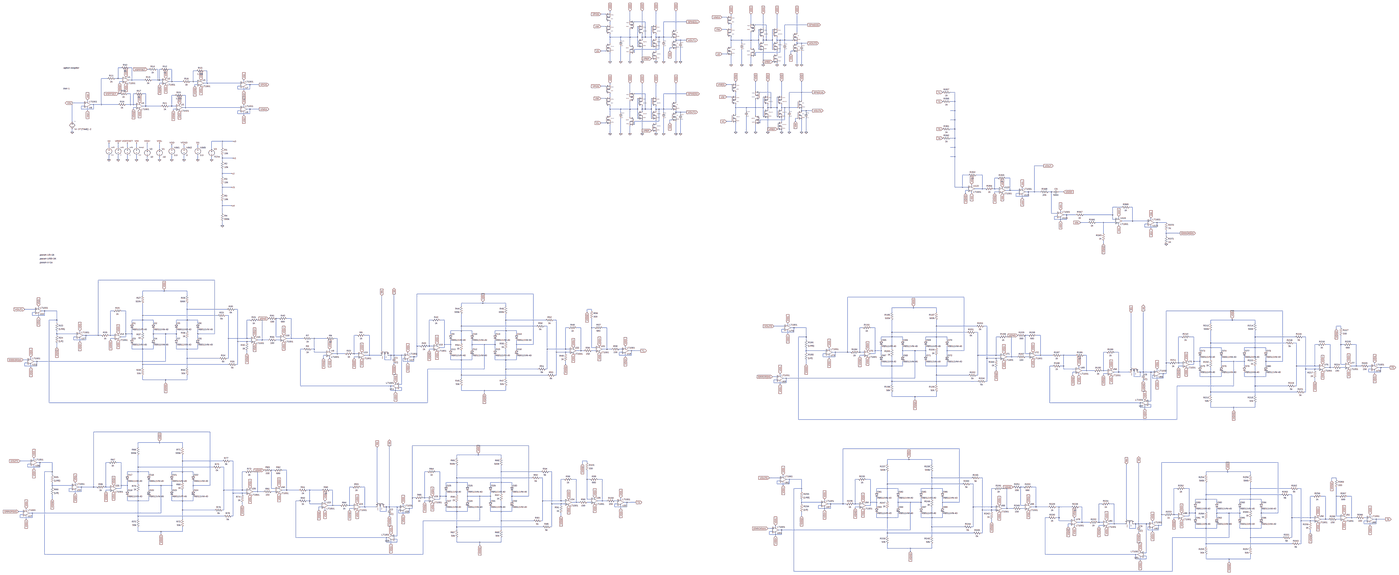
[diagram p0: schematic OZ_8_bounded_curves.asc, whole sheet]
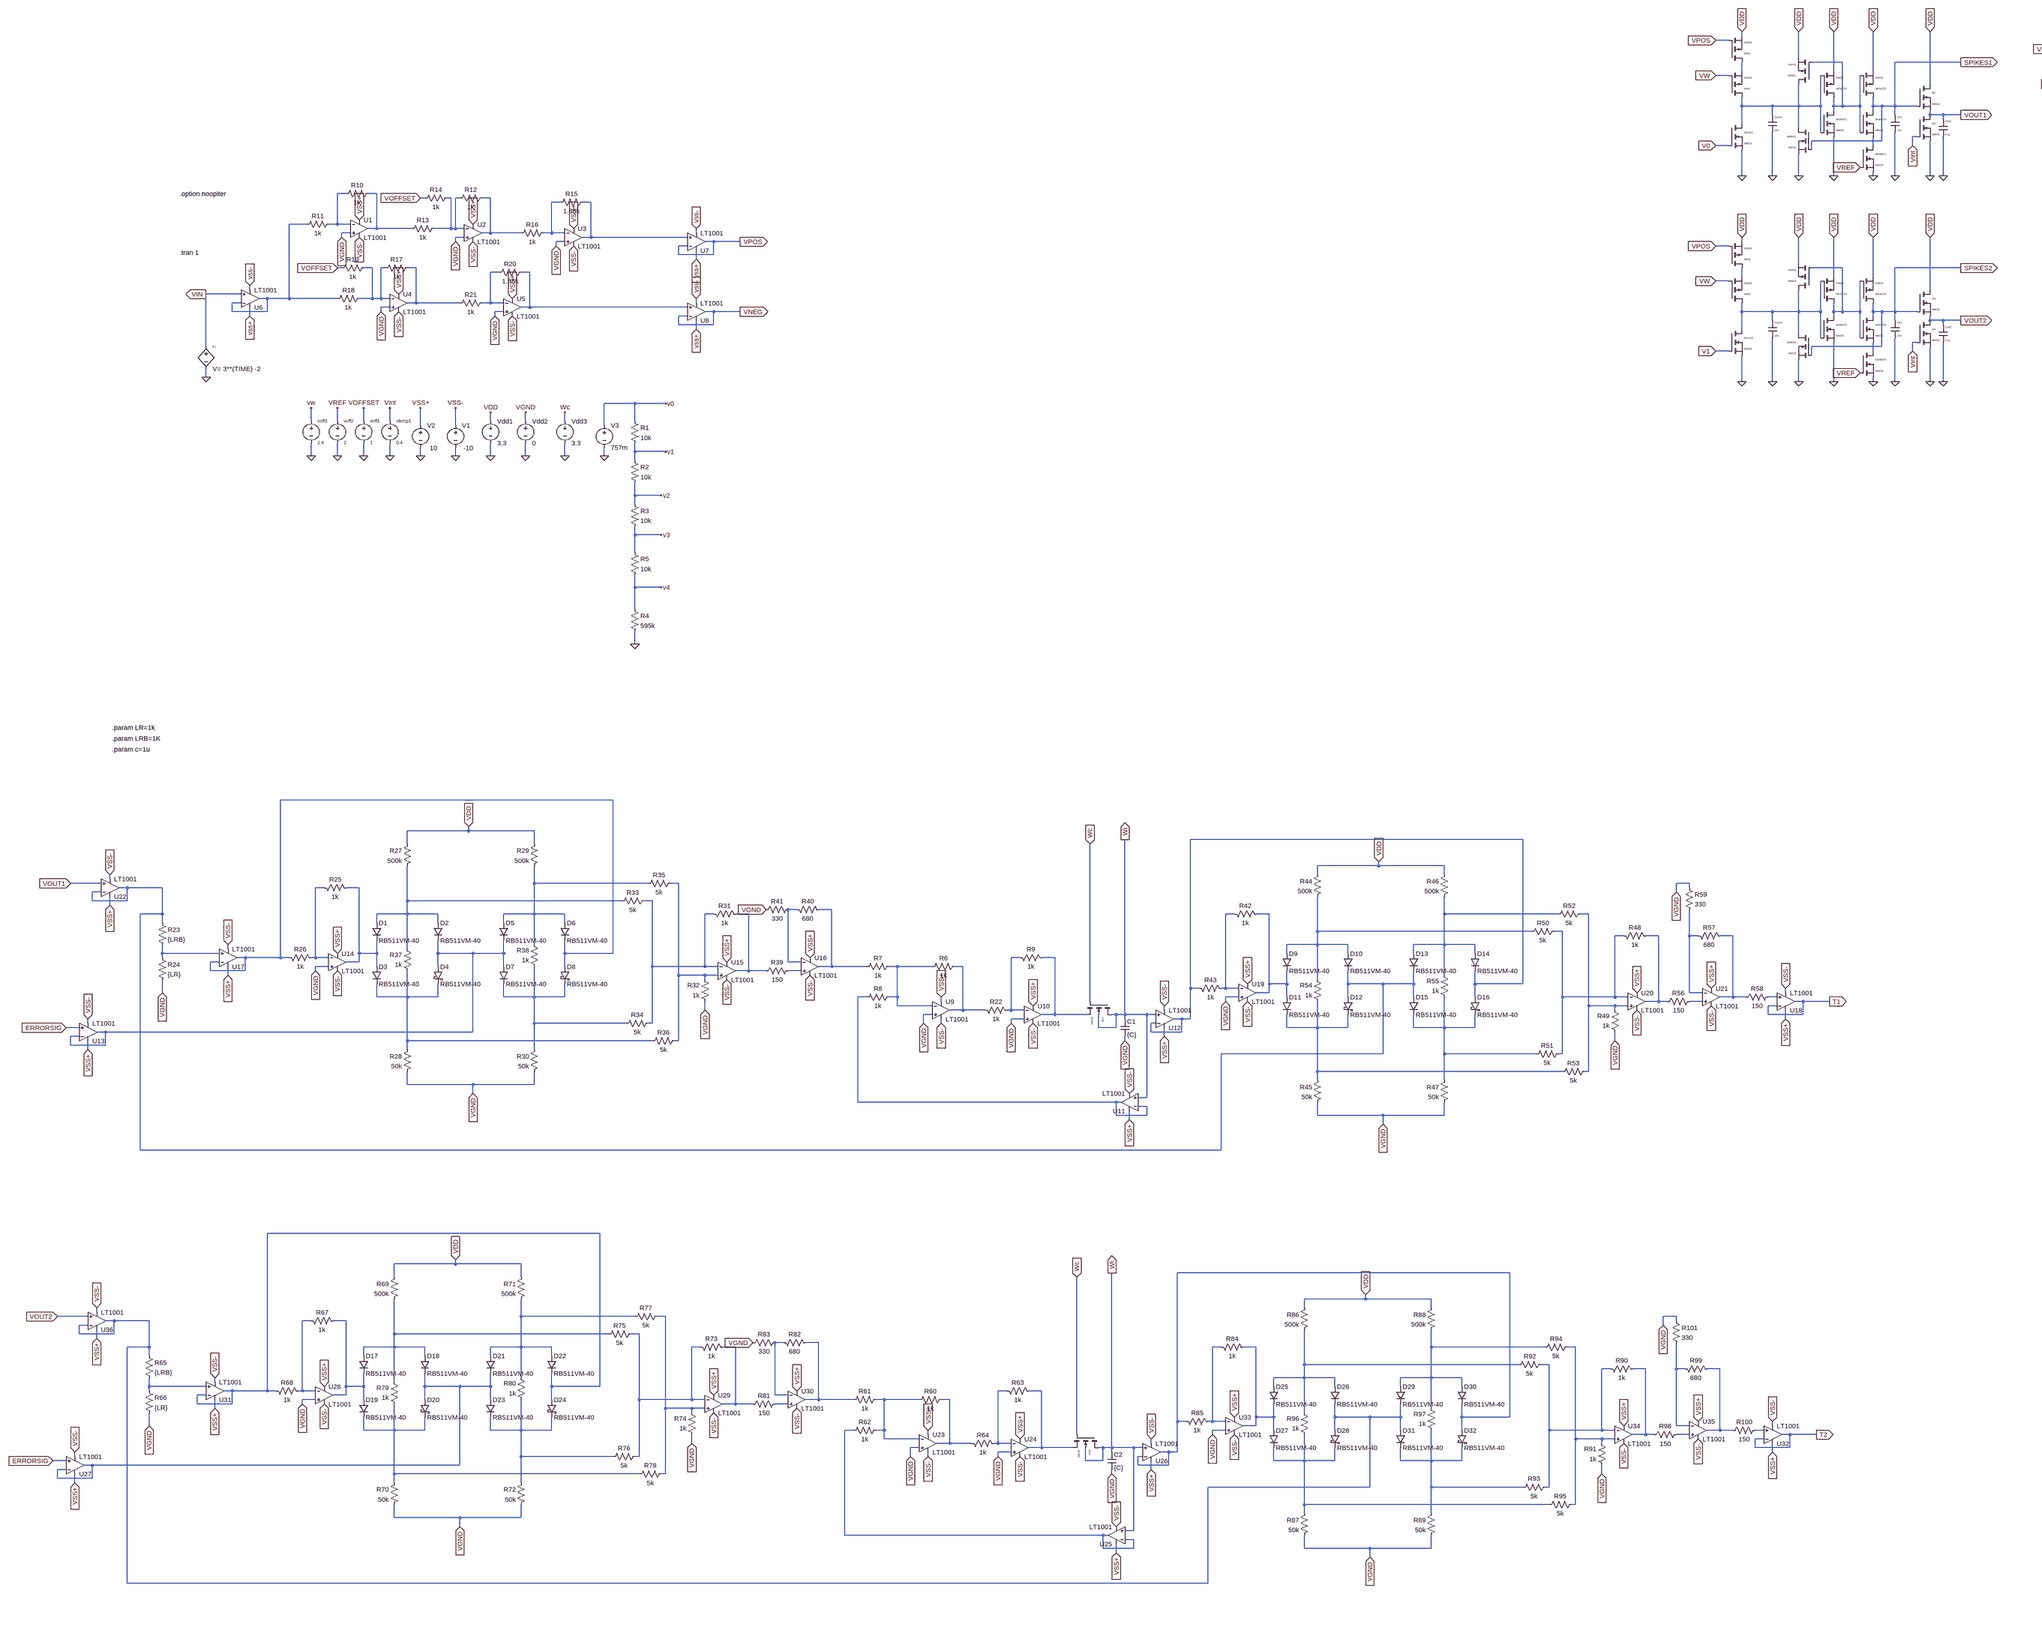
[diagram p1: schematic OZ_8_bounded_curves.asc, part, row 1 of 1, column 1 of 2]
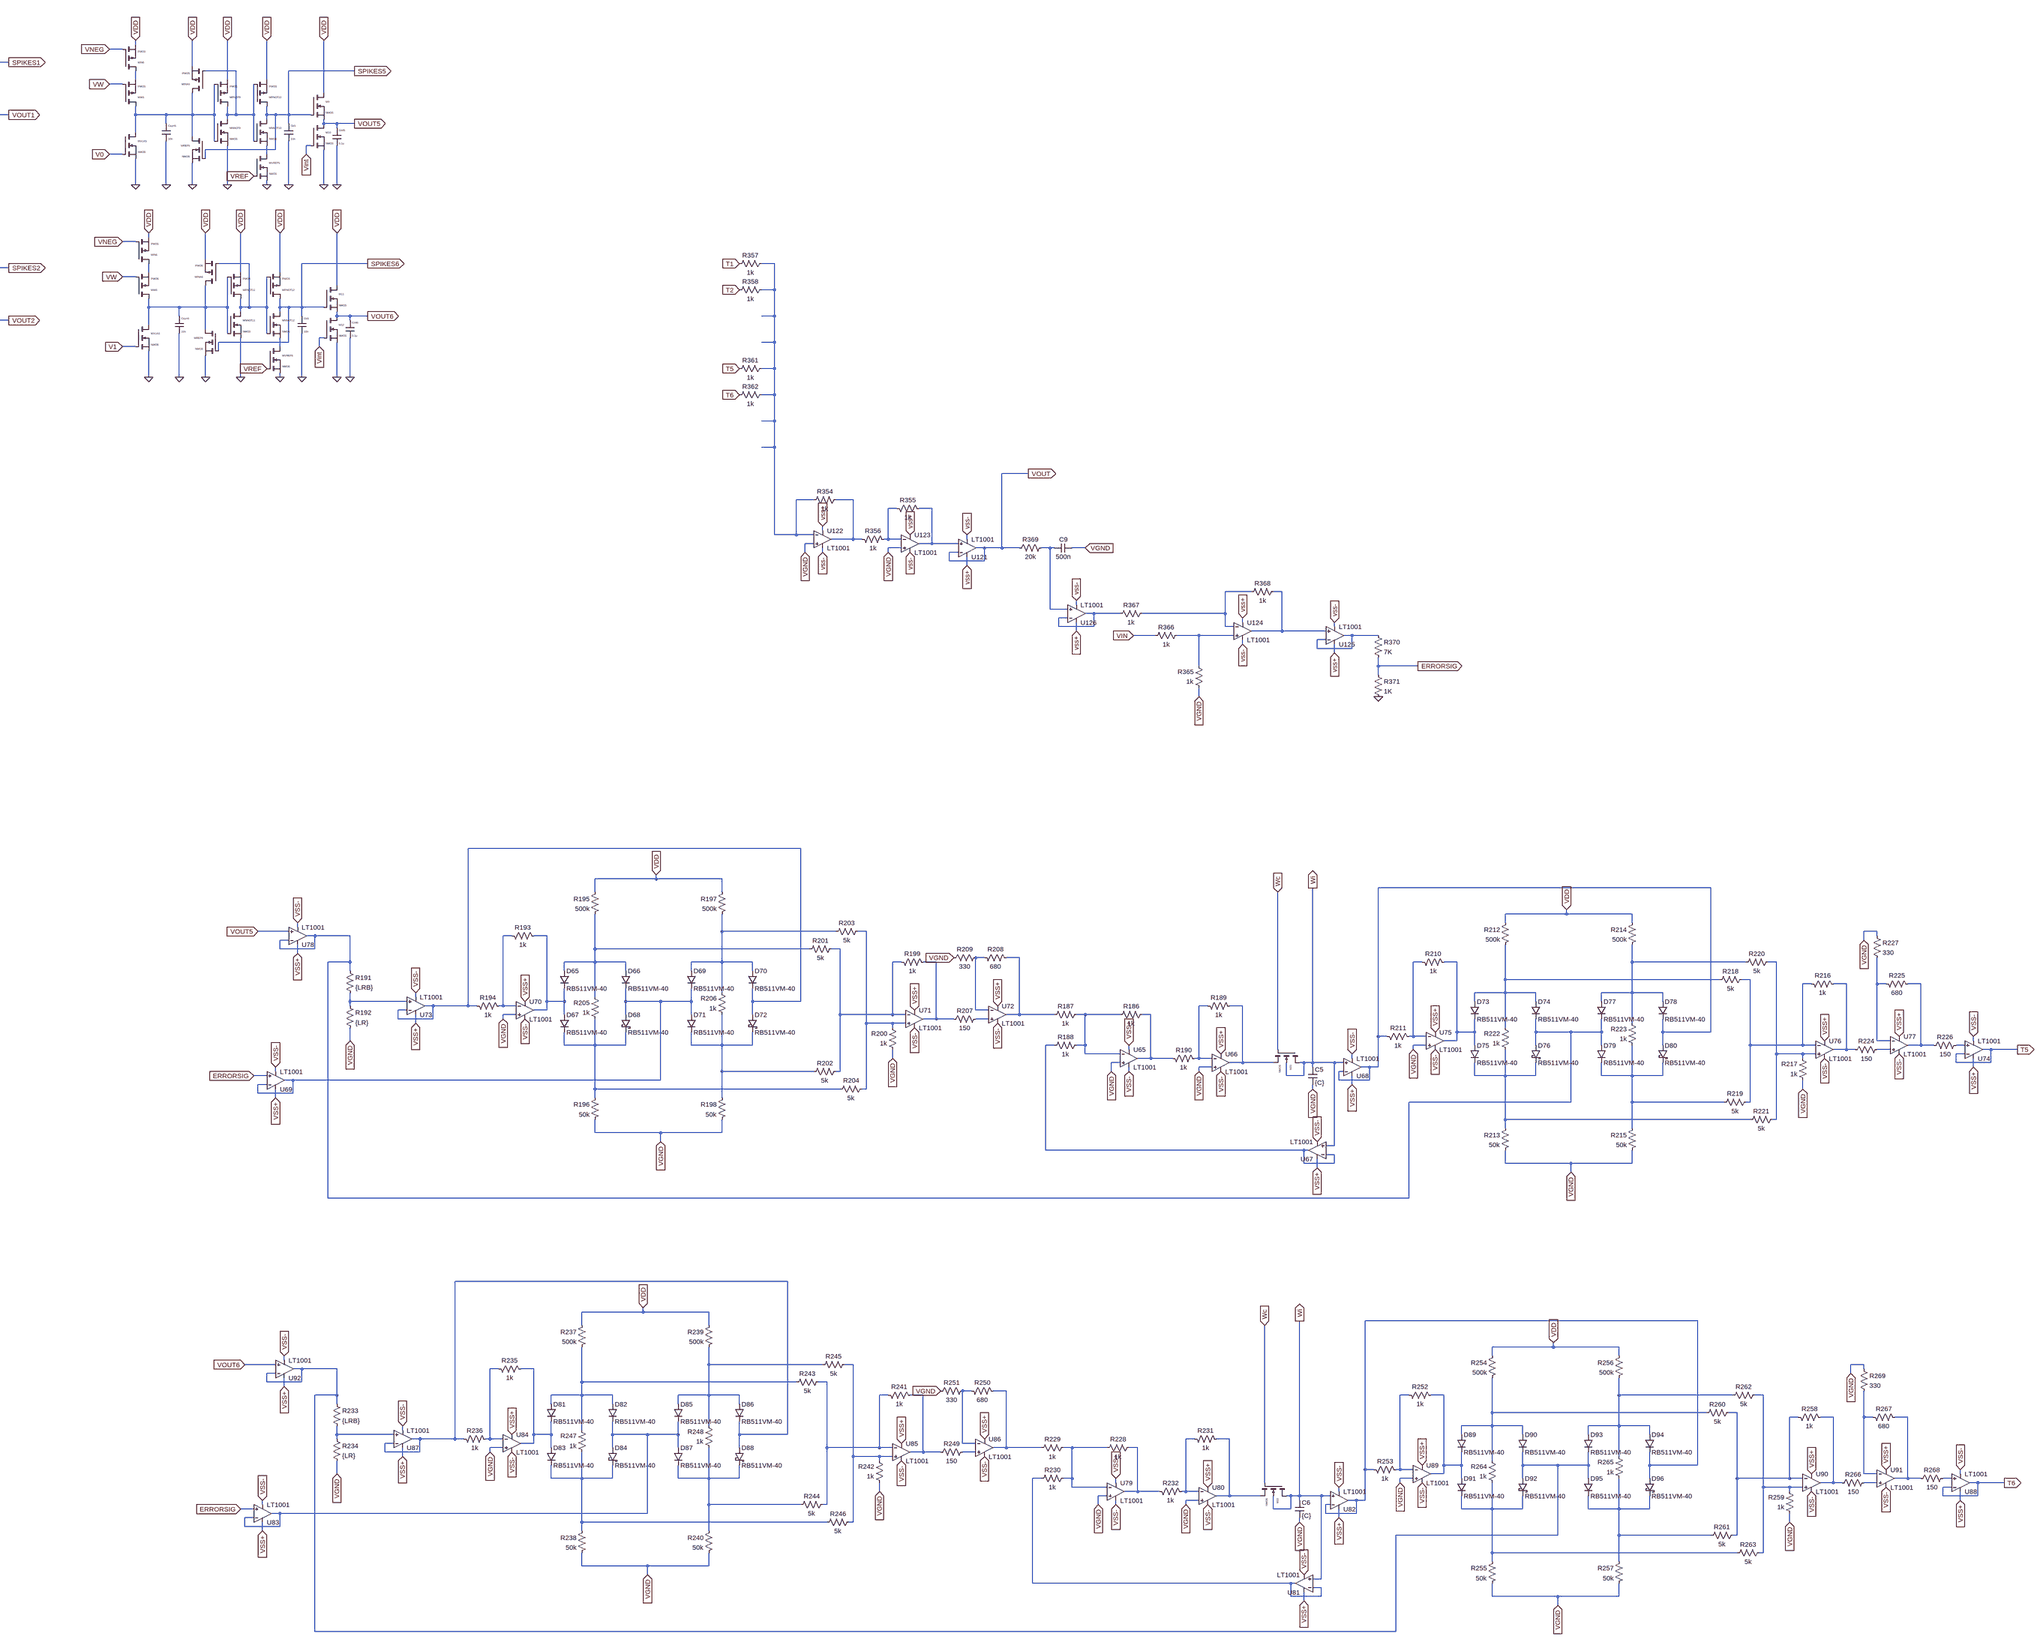
[diagram p2: schematic OZ_8_bounded_curves.asc, part, row 1 of 1, column 2 of 2]
* OZ_8_bounded_curves.asc
vtemp1 Vint 0 0.4
Vdd1 VDD 0 3.3
V1 VSS- 0 -10
V2 VSS+ 0 10
voff1 VOFFSET 0 1
voff2 VREF 0 2
voff3 vw 0 2.4
Vdd2 VGND 0 0
XU1 VGND N009 VSS+ VSS- N010 LT1001  ; pins In+ In- V+ V- OUT
R10 N010 N009 1k
R11 N009 N015 1k
XU2 VGND N011 VSS+ VSS- N012 LT1001  ; pins In+ In- V+ V- OUT
R12 N012 N011 1k
R13 N011 N010 1k
R14 N011 VOFFSET 1k
XU3 VGND N013 VSS+ VSS- N014 LT1001  ; pins In+ In- V+ V- OUT
R15 N014 N013 1.65k
R16 N013 N012 1k
XU4 VGND N018 VSS+ VSS- N019 LT1001  ; pins In+ In- V+ V- OUT
R17 N019 N018 1k
R18 N018 N015 1k
R19 N018 VOFFSET 1k
XU5 VGND N021 VSS+ VSS- N022 LT1001  ; pins In+ In- V+ V- OUT
R20 N022 N021 1.65k
R21 N021 N019 1k
XU6 VIN N015 VSS+ VSS- N015 LT1001  ; pins In+ In- V+ V- OUT
XU7 N014 VPOS VSS+ VSS- VPOS LT1001  ; pins In+ In- V+ V- OUT
XU8 N022 VNEG VSS+ VSS- VNEG LT1001  ; pins In+ In- V+ V- OUT
MW1 N005 vw N002 N002 PMOS
Csyn1 N005 0 10n V=4 Irms=162m Rser=0.395426 Lser=0 mfg="KEMET" pn="C0402C103K7PAC" type="X5R" IC=0
Ck1 SPIKES1 0 10n
MPNOT1 N001 N005 VDD VDD PMOS
MNNOT1 N001 N005 0 0 NMOS
MVREF1 N007 VREF 0 0 NMOS
MREF1 N005 SPIKES1 0 0 NMOS
MVLK1 N005 V0 0 0 NMOS
MINA1 N005 N001 VDD VDD PMOS
MIN1 N002 VPOS VDD VDD PMOS
MPNOT2 SPIKES1 N001 VDD VDD PMOS
MNNOT2 SPIKES1 N001 N007 N007 NMOS
M1 VDD SPIKES1 VOUT1 VOUT1 NMOS
M2 VOUT1 Vint 0 0 NMOS
Cint1 VOUT1 0 0.1µ
MW2 N026 vw N024 N024 PMOS
Csyn2 N026 0 10n V=4 Irms=162m Rser=0.395426 Lser=0 mfg="KEMET" pn="C0402C103K7PAC" type="X5R" IC=0
Ck2 SPIKES2 0 10n
MPNOT3 N020 N026 VDD VDD PMOS
MNNOT3 N020 N026 0 0 NMOS
MVREF2 N028 VREF 0 0 NMOS
MREF2 N026 SPIKES2 0 0 NMOS
MVLK2 N026 V1 0 0 NMOS
MINA2 N026 N020 VDD VDD PMOS
MIN2 N024 VPOS VDD VDD PMOS
MPNOT4 SPIKES2 N020 VDD VDD PMOS
MNNOT4 SPIKES2 N020 N028 N028 NMOS
M3 VDD SPIKES2 VOUT2 VOUT2 NMOS
M4 VOUT2 Vint 0 0 NMOS
Cint2 VOUT2 0 0.1µ
MW5 N006 vw N004 N004 PMOS
Csyn5 N006 0 10n V=4 Irms=162m Rser=0.395426 Lser=0 mfg="KEMET" pn="C0402C103K7PAC" type="X5R" IC=0
Ck5 SPIKES5 0 10n
MPNOT9 N003 N006 VDD VDD PMOS
MNNOT9 N003 N006 0 0 NMOS
MVREF5 N008 VREF 0 0 NMOS
MREF5 N006 SPIKES5 0 0 NMOS
MVLK5 N006 V0 0 0 NMOS
MINA5 N006 N003 VDD VDD PMOS
MIN5 N004 VNEG VDD VDD PMOS
MPNOT10 SPIKES5 N003 VDD VDD PMOS
MNNOT10 SPIKES5 N003 N008 N008 NMOS
M9 VDD SPIKES5 VOUT5 VOUT5 NMOS
M10 VOUT5 Vint 0 0 NMOS
Cint5 VOUT5 0 0.1µ
MW6 N025 vw N023 N023 PMOS
Csyn6 N025 0 10n V=4 Irms=162m Rser=0.395426 Lser=0 mfg="KEMET" pn="C0402C103K7PAC" type="X5R" IC=0
Ck6 SPIKES6 0 10n
MPNOT11 N016 N025 VDD VDD PMOS
MNNOT11 N016 N025 0 0 NMOS
MVREF6 N027 VREF 0 0 NMOS
MREF6 N025 SPIKES6 0 0 NMOS
MVLK6 N025 V1 0 0 NMOS
MINA6 N025 N016 VDD VDD PMOS
MIN6 N023 VNEG VDD VDD PMOS
MPNOT12 SPIKES6 N016 VDD VDD PMOS
MNNOT12 SPIKES6 N016 N027 N027 NMOS
M11 VDD SPIKES6 VOUT6 VOUT6 NMOS
M12 VOUT6 Vint 0 0 NMOS
Cint6 VOUT6 0 0.1µ
V3 V0 0 757m
R1 V0 V1 10k
R2 V1 v2 10k
R3 v2 v3 10k
R4 v4 0 595k
R5 v3 v4 10k
XU121 N031 VOUT VSS+ VSS- VOUT LT1001  ; pins In+ In- V+ V- OUT
XU122 VGND N017 VSS+ VSS- N029 LT1001  ; pins In+ In- V+ V- OUT
R354 N029 N017 1k
XU123 VGND N030 VSS+ VSS- N031 LT1001  ; pins In+ In- V+ V- OUT
R355 N030 N031 1k
R356 N029 N030 1k
R357 N017 T1 1k
R358 N017 T2 1k
R361 N017 T5 1k
R362 N017 T6 1k
M17 Wi Wc N071 Wi NMOS
C1 Wi VGND {C} IC=0
XU9 VGND N079 VSS+ VSS- N080 LT1001  ; pins In+ In- V+ V- OUT
R6 N080 N079 1k
R7 N079 N050 1k
R8 N079 N089 1k
XU10 VGND N070 VSS+ VSS- N071 LT1001  ; pins In+ In- V+ V- OUT
R9 N070 N071 1k
R22 N080 N070 1k
XU11 Wi N089 VSS+ VSS- N089 LT1001  ; pins In+ In- V+ V- OUT
XU12 Wi N039 VSS+ VSS- N039 LT1001  ; pins In+ In- V+ V- OUT
R23 N043 N068 {LRB}
R24 N068 VGND {LR}
XU13 ERRORSIG N069 VSS+ VSS- N069 LT1001  ; pins In+ In- V+ V- OUT
D1 N047 N045 RB511VM-40
XU14 VGND N044 VSS+ VSS- N045 LT1001  ; pins In+ In- V+ V- OUT
R25 N044 N045 1k
R26 N038 N044 1k
D2 N047 N069 RB511VM-40
D3 N045 N087 RB511VM-40
D4 N069 N087 RB511VM-40
R27 VDD N047 500k
R28 N087 VGND 50k
D5 N041 N069 RB511VM-40
D6 N041 N038 RB511VM-40
D7 N069 N088 RB511VM-40
D8 N038 N088 RB511VM-40
R29 VDD N041 500k
R30 N088 VGND 50k
XU15 N042 N048 VSS+ VSS- N051 LT1001  ; pins In+ In- V+ V- OUT
R31 N048 N051 1k
R32 VGND N042 1k
R33 N048 N047 5k
R34 N048 N088 5k
R35 N042 N041 5k
R36 N042 N087 5k
R37 N087 N047 1k
R38 N088 N041 1k
R39 N051 N081 150
XU16 N081 N049 VSS+ VSS- N050 LT1001  ; pins In+ In- V+ V- OUT
R40 N049 N050 680
R41 VGND N049 330
XU17 N068 N038 VSS+ VSS- N038 LT1001  ; pins In+ In- V+ V- OUT
XU18 N090 T1 VSS+ VSS- T1 LT1001  ; pins In+ In- V+ V- OUT
D9 N056 N053 RB511VM-40
XU19 VGND N052 VSS+ VSS- N053 LT1001  ; pins In+ In- V+ V- OUT
R42 N052 N053 1k
R43 N039 N052 1k
D10 N056 N043 RB511VM-40
D11 N053 N099 RB511VM-40
D12 N043 N099 RB511VM-40
R44 VDD N056 500k
R45 N099 VGND 50k
D13 N054 N043 RB511VM-40
D14 N054 N039 RB511VM-40
D15 N043 N100 RB511VM-40
D16 N039 N100 RB511VM-40
R46 VDD N054 500k
R47 N100 VGND 50k
XU20 N055 N057 VSS+ VSS- N060 LT1001  ; pins In+ In- V+ V- OUT
R48 N057 N060 1k
R49 VGND N055 1k
R50 N057 N056 5k
R51 N057 N100 5k
R52 N055 N054 5k
R53 N055 N099 5k
R54 N099 N056 1k
R55 N100 N054 1k
R56 N060 N091 150
XU21 N091 N061 VSS+ VSS- N062 LT1001  ; pins In+ In- V+ V- OUT
R57 N061 N062 680
R58 N062 N090 150
R59 VGND N061 330
XU22 VOUT1 N043 VSS+ VSS- N043 LT1001  ; pins In+ In- V+ V- OUT
M18 Wi Wc N141 Wi NMOS
C2 Wi VGND {C} IC=0
XU23 VGND N149 VSS+ VSS- N150 LT1001  ; pins In+ In- V+ V- OUT
R60 N150 N149 1k
R61 N149 N120 1k
R62 N149 N159 1k
XU24 VGND N140 VSS+ VSS- N141 LT1001  ; pins In+ In- V+ V- OUT
R63 N140 N141 1k
R64 N150 N140 1k
XU25 Wi N159 VSS+ VSS- N159 LT1001  ; pins In+ In- V+ V- OUT
XU26 Wi N109 VSS+ VSS- N109 LT1001  ; pins In+ In- V+ V- OUT
R65 N113 N138 {LRB}
R66 N138 VGND {LR}
XU27 ERRORSIG N139 VSS+ VSS- N139 LT1001  ; pins In+ In- V+ V- OUT
D17 N117 N115 RB511VM-40
XU28 VGND N114 VSS+ VSS- N115 LT1001  ; pins In+ In- V+ V- OUT
R67 N114 N115 1k
R68 N108 N114 1k
D18 N117 N139 RB511VM-40
D19 N115 N157 RB511VM-40
D20 N139 N157 RB511VM-40
R69 VDD N117 500k
R70 N157 VGND 50k
D21 N111 N139 RB511VM-40
D22 N111 N108 RB511VM-40
D23 N139 N158 RB511VM-40
D24 N108 N158 RB511VM-40
R71 VDD N111 500k
R72 N158 VGND 50k
XU29 N112 N118 VSS+ VSS- N121 LT1001  ; pins In+ In- V+ V- OUT
R73 N118 N121 1k
R74 VGND N112 1k
R75 N118 N117 5k
R76 N118 N158 5k
R77 N112 N111 5k
R78 N112 N157 5k
R79 N157 N117 1k
R80 N158 N111 1k
R81 N121 N151 150
XU30 N151 N119 VSS+ VSS- N120 LT1001  ; pins In+ In- V+ V- OUT
R82 N119 N120 680
R83 VGND N119 330
XU31 N138 N108 VSS+ VSS- N108 LT1001  ; pins In+ In- V+ V- OUT
XU32 N160 T2 VSS+ VSS- T2 LT1001  ; pins In+ In- V+ V- OUT
D25 N126 N123 RB511VM-40
XU33 VGND N122 VSS+ VSS- N123 LT1001  ; pins In+ In- V+ V- OUT
R84 N122 N123 1k
R85 N109 N122 1k
D26 N126 N113 RB511VM-40
D27 N123 N169 RB511VM-40
D28 N113 N169 RB511VM-40
R86 VDD N126 500k
R87 N169 VGND 50k
D29 N124 N113 RB511VM-40
D30 N124 N109 RB511VM-40
D31 N113 N170 RB511VM-40
D32 N109 N170 RB511VM-40
R88 VDD N124 500k
R89 N170 VGND 50k
XU34 N125 N127 VSS+ VSS- N130 LT1001  ; pins In+ In- V+ V- OUT
R90 N127 N130 1k
R91 VGND N125 1k
R92 N127 N126 5k
R93 N127 N170 5k
R94 N125 N124 5k
R95 N125 N169 5k
R96 N169 N126 1k
R97 N170 N124 1k
R98 N130 N161 150
XU35 N161 N131 VSS+ VSS- N132 LT1001  ; pins In+ In- V+ V- OUT
R99 N131 N132 680
R100 N132 N160 150
R101 VGND N131 330
XU36 VOUT2 N113 VSS+ VSS- N113 LT1001  ; pins In+ In- V+ V- OUT
M21 Wi Wc N095 Wi NMOS
C5 Wi VGND {C} IC=0
XU65 VGND N096 VSS+ VSS- N097 LT1001  ; pins In+ In- V+ V- OUT
R186 N097 N096 1k
R187 N096 N073 1k
R188 N096 N103 1k
XU66 VGND N094 VSS+ VSS- N095 LT1001  ; pins In+ In- V+ V- OUT
R189 N094 N095 1k
R190 N097 N094 1k
XU67 Wi N103 VSS+ VSS- N103 LT1001  ; pins In+ In- V+ V- OUT
XU68 Wi N046 VSS+ VSS- N046 LT1001  ; pins In+ In- V+ V- OUT
R191 N063 N092 {LRB}
R192 N092 VGND {LR}
XU69 ERRORSIG N093 VSS+ VSS- N093 LT1001  ; pins In+ In- V+ V- OUT
D65 N066 N065 RB511VM-40
XU70 VGND N064 VSS+ VSS- N065 LT1001  ; pins In+ In- V+ V- OUT
R193 N064 N065 1k
R194 N040 N064 1k
D66 N066 N093 RB511VM-40
D67 N065 N101 RB511VM-40
D68 N093 N101 RB511VM-40
R195 VDD N066 500k
R196 N101 VGND 50k
D69 N058 N093 RB511VM-40
D70 N058 N040 RB511VM-40
D71 N093 N102 RB511VM-40
D72 N040 N102 RB511VM-40
R197 VDD N058 500k
R198 N102 VGND 50k
XU71 N059 N067 VSS+ VSS- N074 LT1001  ; pins In+ In- V+ V- OUT
R199 N067 N074 1k
R200 VGND N059 1k
R201 N067 N066 5k
R202 N067 N102 5k
R203 N059 N058 5k
R204 N059 N101 5k
R205 N101 N066 1k
R206 N102 N058 1k
R207 N074 N098 150
XU72 N098 N072 VSS+ VSS- N073 LT1001  ; pins In+ In- V+ V- OUT
R208 N072 N073 680
R209 VGND N072 330
XU73 N092 N040 VSS+ VSS- N040 LT1001  ; pins In+ In- V+ V- OUT
XU74 N104 T5 VSS+ VSS- T5 LT1001  ; pins In+ In- V+ V- OUT
D73 N082 N076 RB511VM-40
XU75 VGND N075 VSS+ VSS- N076 LT1001  ; pins In+ In- V+ V- OUT
R210 N075 N076 1k
R211 N046 N075 1k
D74 N082 N063 RB511VM-40
D75 N076 N106 RB511VM-40
D76 N063 N106 RB511VM-40
R212 VDD N082 500k
R213 N106 VGND 50k
D77 N077 N063 RB511VM-40
D78 N077 N046 RB511VM-40
D79 N063 N107 RB511VM-40
D80 N046 N107 RB511VM-40
R214 VDD N077 500k
R215 N107 VGND 50k
XU76 N078 N083 VSS+ VSS- N084 LT1001  ; pins In+ In- V+ V- OUT
R216 N083 N084 1k
R217 VGND N078 1k
R218 N083 N082 5k
R219 N083 N107 5k
R220 N078 N077 5k
R221 N078 N106 5k
R222 N106 N082 1k
R223 N107 N077 1k
R224 N084 N105 150
XU77 N105 N085 VSS+ VSS- N086 LT1001  ; pins In+ In- V+ V- OUT
R225 N085 N086 680
R226 N086 N104 150
R227 VGND N085 330
XU78 VOUT5 N063 VSS+ VSS- N063 LT1001  ; pins In+ In- V+ V- OUT
M22 Wi Wc N165 Wi NMOS
C6 Wi VGND {C} IC=0
XU79 VGND N166 VSS+ VSS- N167 LT1001  ; pins In+ In- V+ V- OUT
R228 N167 N166 1k
R229 N166 N143 1k
R230 N166 N173 1k
XU80 VGND N164 VSS+ VSS- N165 LT1001  ; pins In+ In- V+ V- OUT
R231 N164 N165 1k
R232 N167 N164 1k
XU81 Wi N173 VSS+ VSS- N173 LT1001  ; pins In+ In- V+ V- OUT
XU82 Wi N116 VSS+ VSS- N116 LT1001  ; pins In+ In- V+ V- OUT
R233 N133 N162 {LRB}
R234 N162 VGND {LR}
XU83 ERRORSIG N163 VSS+ VSS- N163 LT1001  ; pins In+ In- V+ V- OUT
D81 N136 N135 RB511VM-40
XU84 VGND N134 VSS+ VSS- N135 LT1001  ; pins In+ In- V+ V- OUT
R235 N134 N135 1k
R236 N110 N134 1k
D82 N136 N163 RB511VM-40
D83 N135 N171 RB511VM-40
D84 N163 N171 RB511VM-40
R237 VDD N136 500k
R238 N171 VGND 50k
D85 N128 N163 RB511VM-40
D86 N128 N110 RB511VM-40
D87 N163 N172 RB511VM-40
D88 N110 N172 RB511VM-40
R239 VDD N128 500k
R240 N172 VGND 50k
XU85 N129 N137 VSS+ VSS- N144 LT1001  ; pins In+ In- V+ V- OUT
R241 N137 N144 1k
R242 VGND N129 1k
R243 N137 N136 5k
R244 N137 N172 5k
R245 N129 N128 5k
R246 N129 N171 5k
R247 N171 N136 1k
R248 N172 N128 1k
R249 N144 N168 150
XU86 N168 N142 VSS+ VSS- N143 LT1001  ; pins In+ In- V+ V- OUT
R250 N142 N143 680
R251 VGND N142 330
XU87 N162 N110 VSS+ VSS- N110 LT1001  ; pins In+ In- V+ V- OUT
XU88 N174 T6 VSS+ VSS- T6 LT1001  ; pins In+ In- V+ V- OUT
D89 N152 N146 RB511VM-40
XU89 VGND N145 VSS+ VSS- N146 LT1001  ; pins In+ In- V+ V- OUT
R252 N145 N146 1k
R253 N116 N145 1k
D90 N152 N133 RB511VM-40
D91 N146 N176 RB511VM-40
D92 N133 N176 RB511VM-40
R254 VDD N152 500k
R255 N176 VGND 50k
D93 N147 N133 RB511VM-40
D94 N147 N116 RB511VM-40
D95 N133 N177 RB511VM-40
D96 N116 N177 RB511VM-40
R256 VDD N147 500k
R257 N177 VGND 50k
XU90 N148 N153 VSS+ VSS- N154 LT1001  ; pins In+ In- V+ V- OUT
R258 N153 N154 1k
R259 VGND N148 1k
R260 N153 N152 5k
R261 N153 N177 5k
R262 N148 N147 5k
R263 N148 N176 5k
R264 N176 N152 1k
R265 N177 N147 1k
R266 N154 N175 150
XU91 N175 N155 VSS+ VSS- N156 LT1001  ; pins In+ In- V+ V- OUT
R267 N155 N156 680
R268 N156 N174 150
R269 VGND N155 330
XU92 VOUT6 N133 VSS+ VSS- N133 LT1001  ; pins In+ In- V+ V- OUT
XU124 N036 N033 VSS+ VSS- N034 LT1001  ; pins In+ In- V+ V- OUT
R365 VGND N036 1k
R366 N036 VIN 1k
R367 N033 N035 1k
R368 N034 N033 1k
XU125 N034 N037 VSS+ VSS- N037 LT1001  ; pins In+ In- V+ V- OUT
R369 VOUT N032 20k
C9 N032 VGND 500n
XU126 N032 N035 VSS+ VSS- N035 LT1001  ; pins In+ In- V+ V- OUT
R370 N037 ERRORSIG 7K
R371 ERRORSIG 0 1K
Vdd3 Wc 0 3.3
B1 VIN 0 V= 3**(TIME) -2
.model D D
.lib standard.dio
.model NMOS NMOS
.model PMOS PMOS
.lib standard.mos
.tran 1
.option noopiter
.param LR=1k
.param LRB=1K
.param c=1u
.lib LTC.lib
.backanno
.end